# EAGLE design bitraf-bylarm-synth (EAGLE 6.5.0)
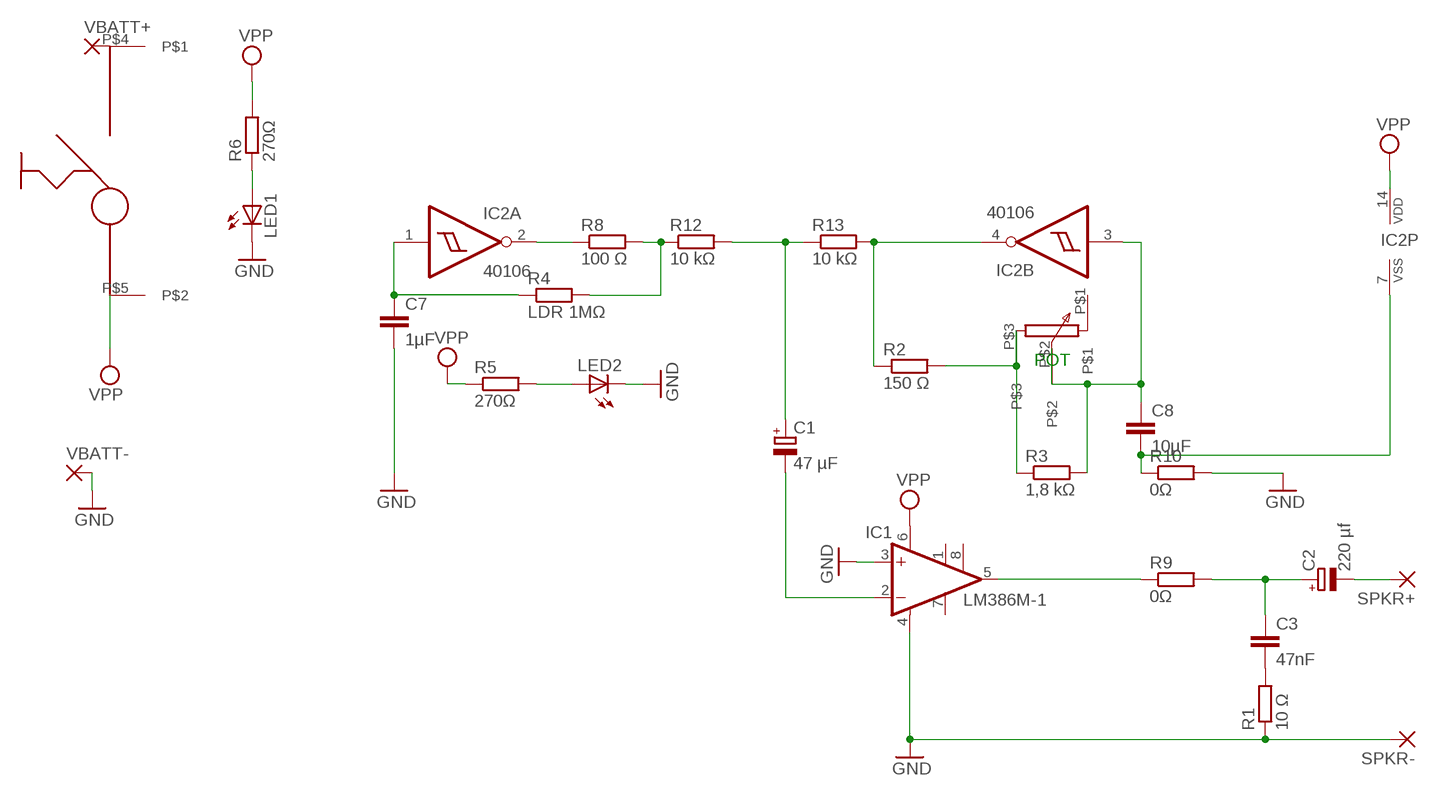
[diagram p0: schematic, sheet 1]

## Parts
C1  47 µF  CPOL-EU153CLV-0605  [153CLV-0605]
C2  220 µf  CPOL-EU153CLV-0605  [153CLV-0605]
C3  47nF  C-EUC0402  [C0402]
C7  1µF  C-EUC0603  [C0603]
C8  10µF  C-EUC1206  [C1206]
IC1  LM386M-1  [SO08]
IC2  40106  40106D  [SO14]
LED1  LED3MM  [LED3MM]
LED2  LEDP-LCC-2  [P-LCC-2]
R1  10 Ω  R-EU_R2512  [R2512]
R2  150 Ω  R-EU_R1206  [R1206]
R3  1,8 kΩ  R-EU_R1206  [R1206]
R4  LDR 1MΩ  R-EU_0204/2V  [0204V]
R5  270Ω  R-EU_R2512  [R2512]
R6  270Ω  R-EU_R2512  [R2512]
R8  100 Ω  R-EU_R1206  [R1206]
R9  0Ω  R-EU_R1206  [R1206]
R10  0Ω  R-EU_R1206  [R1206]
R12  10 kΩ  R-EU_R1206  [R1206]
R13  10 kΩ  R-EU_R1206  [R1206]
SPKR+  1,6/0,9  [1,6/0,9]
SPKR-  1,6/0,9  [1,6/0,9]
U$1  SMALLPOT  [SMALLPOT]
U$2  BYLARMSWITCH  [BYLARMSWITCH]
VBATT+  2,15/1,0  [2,15/1,0]
VBATT-  2,15/1,0  [2,15/1,0]

## Nets
GND: C7.2 IC1.3(+IN) IC1.4(GND) LED1.K(C) LED2.C R1.1 R10.2 SPKR-.1(P) VBATT-.1(P)
N$1: R4.2 R8.2 R12.1
N$2: C2.+ C3.1 R9.2
N$3: C1.- IC1.2(-IN)
N$4: C3.2 R1.2
N$5: R2.2 R3.1 U$1.P$3
N$6: C8.1 IC2.3(B:I) R3.2 U$1.P$2
N$7: LED1.A R6.1
N$8: LED2.A R5.2
N$9: U$2.P$4 VBATT+.1(P)
N$10: C1.+ R12.2 R13.1
N$11: C7.1 IC2.1(A:I) R4.1
N$12: C8.2 IC2.7(P:VSS) R10.1
N$13: IC1.5(OUT) R9.1
N$15: IC2.2(A:O) R8.1
N$21: IC2.4(B:O) R2.1 R13.2
SPKR+: C2.- SPKR+.1(P)
VPP: IC1.6(VS) IC2.14(P:VDD) R5.1 R6.2 U$2.P$5
Unconnected: IC1.1(GAIN) IC1.7(BYPASS) IC1.8(GAIN) IC2.5(C:I) IC2.6(C:O) IC2.8(D:O) IC2.9(D:I) IC2.10(E:O) IC2.11(E:I) IC2.12(F:O) IC2.13(F:I) U$1.P$1

## Notes on the sheet
- POT

## Library data of the parts
C1 C2 = rcl:CPOL-EU: POLARIZED CAPACITOR, European symbol
C3 C7 C8 = rcl:C-EU: CAPACITOR, European symbol
IC1 = linear:LM386?-*: Low Voltage Audio Power Amplifier Source: http://cache.national.com/ds/LM/LM386.pdf
IC2 = 40xx:40106: Hex SCHMITT TRIGGER
LED1 LED2 = led:LED: LED OSRAM: - CHIPLED LG R971, LG N971, LY N971, LG Q971, LY Q971, LO R971, LY R971 LH N974, LH R974 LS Q976, LO Q976, LY Q976 LO Q996 - Hyper CHIPLED LW Q18S LB Q993, LB Q99A, LB R99A - SideLED LS A670, LO A670, LY A670, LG A670, LP A670 LB A673, LV A673, LT A673, LW A673 LH A674 LY A675 LS A676, LA A676, LO A676, LY A676, LW A676 LS A679, LY A679, LG A679 - Hyper Micro SIDELED® LS Y876, LA Y876, LO Y876, LY Y876 LT Y87S - SmartLED LW L88C, LW L88S LB L89C, LB L89S, LG L890 LS L89K, LO L89K, LY L89K LS L896, LA L896, LO L896, LY L896 - TOPLED LS T670, LO T670, LY T670, LG T670, LP T670 LSG T670, LSP T670, LSY T670, LOP T670, LYG T670 LG T671, LOG T671, LSG T671 LB T673, LV T673, LT T673, LW T673 LH T674 LS T676, LA T676, LO T676, LY T676, LB T676, LH T676, LSB T676, LW T676 LB T67C, LV T67C, LT T67C, LS T67K, LO T67K, LY T67K, LW E67C LS E67B, LA E67B, LO E67B, LY E67B, LB E67C, LV E67C, LT E67C LW T67C LS T679, LY T679, LG T679 LS T770, LO T770, LY T770, LG T770, LP T770 LB T773, LV T773, LT T773, LW T773 LH T774 LS E675, LA E675, LY E675, LS T675 LS T776, LA T776, LO T776, LY T776, LB T776 LHGB T686 LT T68C, LB T68C - Hyper Mini TOPLED® LB M676 - Mini TOPLED Santana® LG M470 LS M47K, LO M47K, LY M47K Source: http://www.osram.convergy.de LUXEON: - LUMILED® LXK2-PW12-R00, LXK2-PW12-S00, LXK2-PW14-U00, LXK2-PW14-V00 LXK2-PM12-R00, LXK2-PM12-S00, LXK2-PM14-U00 LXK2-PE12-Q00, LXK2-PE12-R00, LXK2-PE12-S00, LXK2-PE14-T00, LXK2-PE14-U00 LXK2-PB12-K00, LXK2-PB12-L00, LXK2-PB12-M00, LXK2-PB14-N00, LXK2-PB14-P00, LXK2-PB14-Q00 LXK2-PR12-L00, LXK2-PR12-M00, LXK2-PR14-Q00, LXK2-PR14-R00 LXK2-PD12-Q00, LXK2-PD12-R00, LXK2-PD12-S00 LXK2-PH12-R00, LXK2-PH12-S00 LXK2-PL12-P00, LXK2-PL12-Q00, LXK2-PL12-R00 Source: www.luxeon.com KINGBRIGHT: KA-3528ASYC Source: www.kingbright.com
R1-R6 R8-R10 R12 R13 = rcl:R-EU_: RESISTOR, European symbol
SPKR+ SPKR- = wirepad:1,6/0,9: THROUGH-HOLE PAD
U$1 = smallpot:SMALLPOT
U$2 = bylarmSwitch:BYLARMSWITCH
VBATT+ VBATT- = wirepad:2,15/1,0: THROUGH-HOLE PAD

## Board
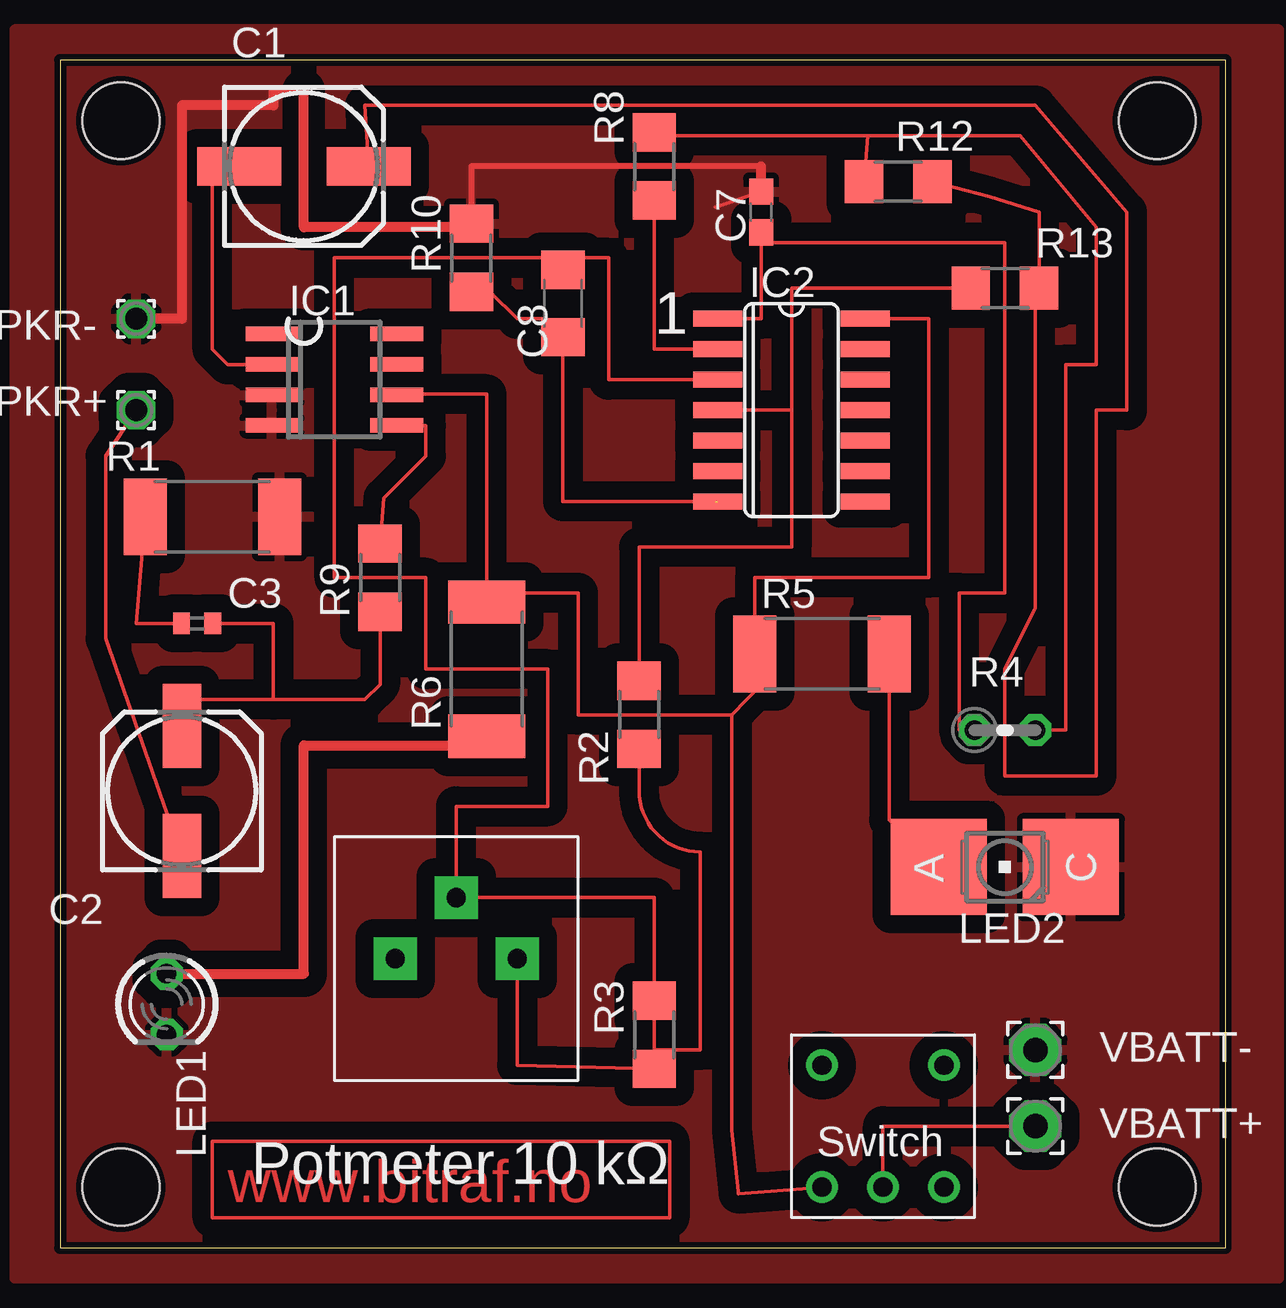
[diagram p1: board, top side]
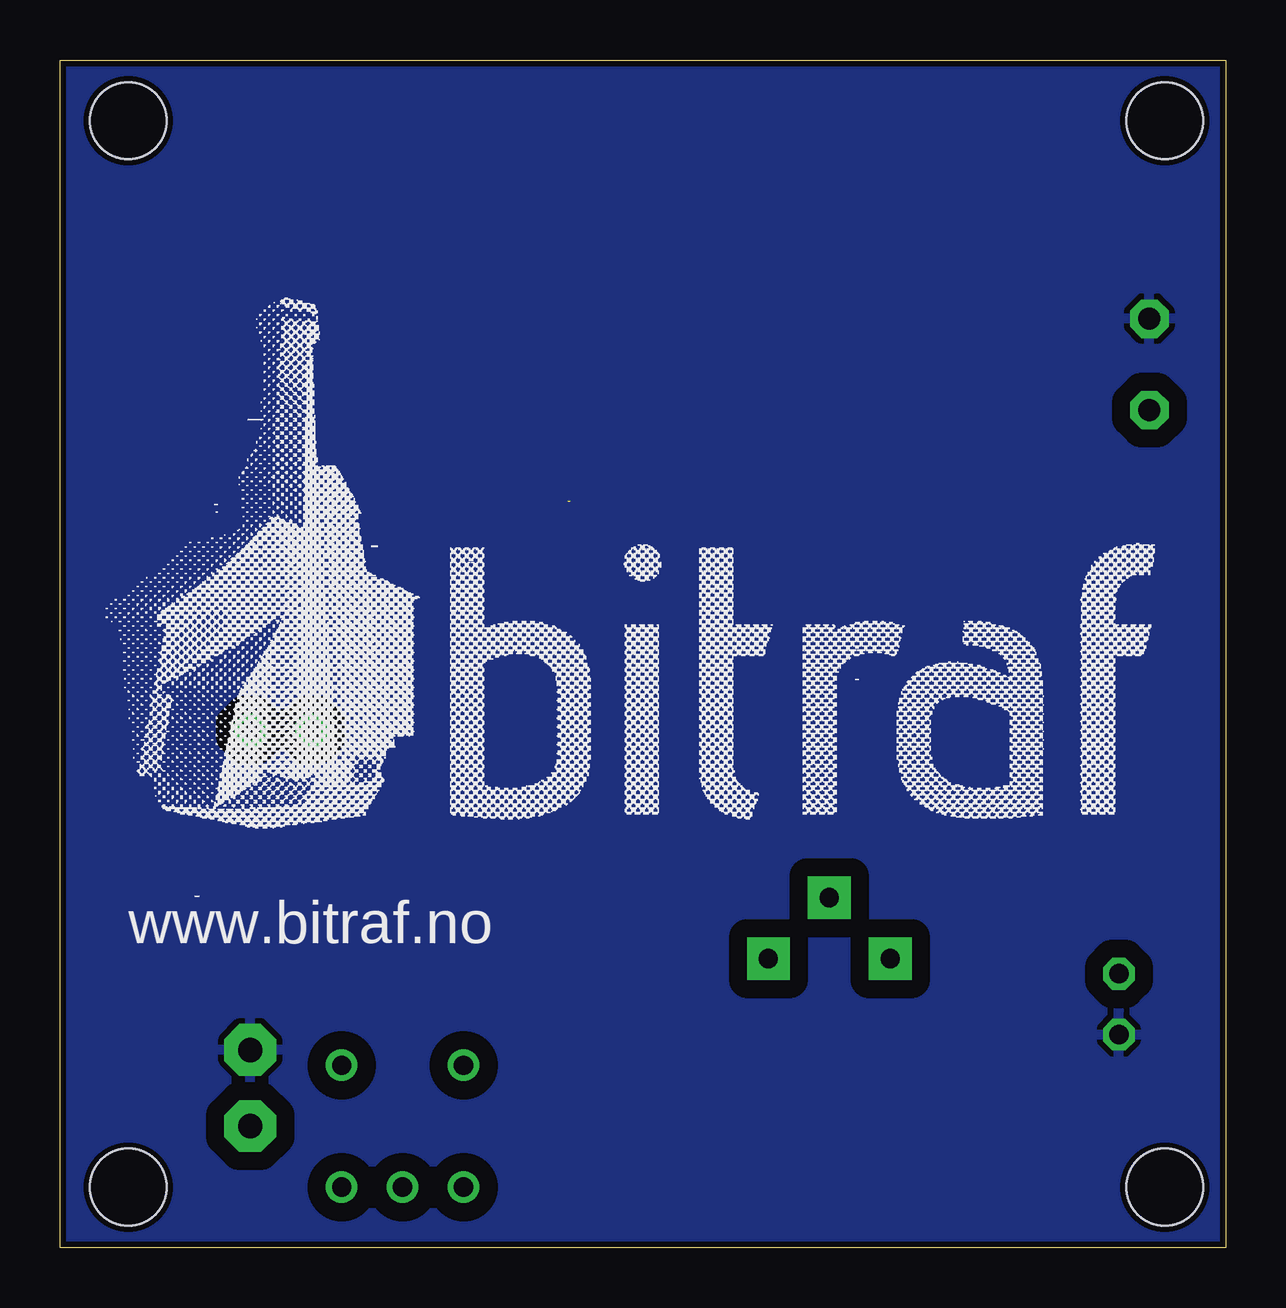
[diagram p2: board, bottom side, seen from below]

Size 48.56 x 49.52 mm. Coordinates in mm from the lower left corner, seen from the top.
Outline: 0,0 48.56,0 48.56,49.52 0,49.52 0,0
Copper layers (1*16): Top 0.035mm / dielectric 1.5mm / Bottom 0.035mm
Design rules "SeeedStudio_DRU-2layer_no_angle_20130527 *": minimum track width 6mil, minimum drill 12mil, track to track 30mil, track to pad 30mil, pad to pad 30mil, via to via 30mil, smd to smd 0mil, copper to edge 10mil, drill to drill 10mil, minimum pad ring 10mil, minimum via ring 6mil, stop-mask expansion 2mil, vias tented up to drill 25mil, thermal gap 10mil
Holes 3.2 mm at 2.54,2.54 2.54,46.99 45.72,46.99 45.72,2.54

### Footprints (pad centres in the part's own frame; a part is rotated, then mirrored left to right if it is on the bottom)
153CLV-0605 = smd 3.5 x 1.6: + 2.7,0; - -2.7,0
C0402 = smd 0.7 x 0.9: 1 -0.65,0; 2 0.65,0
C0603 = smd 1.1 x 1: 1 -0.85,0; 2 0.85,0
C1206 = smd 1.6 x 1.8: 1 -1.4,0; 2 1.4,0
SO08 = smd 0.6 x 2.2: 1 -1.905,-2.6; 2 -0.635,-2.6; 3 0.635,-2.6; 4 1.905,-2.6; 5 1.905,2.6; 6 0.635,2.6; 7 -0.635,2.6; 8 -1.905,2.6
SO14 = smd 0.66 x 2.032: 1 -3.81,-3.073; 2 -2.54,-3.073; 3 -1.27,-3.073; 4 0,-3.073; 5 1.27,-3.073; 6 2.54,-3.073; 7 3.81,-3.073; 8 3.81,3.073; 9 2.54,3.073; 10 1.27,3.073; 11 0,3.073; 12 -1.27,3.073; 13 -2.54,3.073; 14 -3.81,3.073
LED3MM = drill 0.813 octagon: A -1.27,0; K 1.27,0
P-LCC-2 = smd 4 x 4: A 0,2.75; C 0,-2.75
R2512 = smd 1.8 x 3.2: 1 -2.8,0; 2 2.8,0
R1206 = smd 1.6 x 1.803: 1 -1.422,0; 2 1.422,0
0204V = drill 0.813 octagon: 1 -1.27,0; 2 1.27,0
1,6/0,9 = drill 0.914 pad 1.6 octagon: 1 0,0
SMALLPOT = drill 0.8 pad 1.778 square: P$1 2.54,5.08; P$2 5.08,7.62; P$3 7.62,5.08
BYLARMSWITCH = drill 0.8: P$1 1.27,1.27; P$2 6.35,1.27; P$3 1.27,6.35; P$4 3.81,6.35; P$5 6.35,6.35
2,15/1,0 = drill 1.016 pad 2.159 octagon: 1 0,0

### Placement (x,y rotation side)
C1  10.16,45.09 0 top
C2  5.08,19.05 90 top
C3  5.71,26.04 180 top
C7  29.21,43.18 90 top
C8  20.95,39.37 270 top
IC1  11.43,36.2 270 top
IC2  30.48,34.92 270 top
LED1  4.45,10.16 270 top
LED2  39.37,15.88 90 top
R1  6.35,30.48 180 top
R2  24.13,22.23 270 top
R3  24.77,8.89 90 top
R4  39.37,21.59 0 top
R5  31.75,24.77 0 top
R6  17.78,24.13 90 top
R8  24.77,45.09 90 top
R9  13.34,27.94 270 top
R10  17.14,41.27 90 top
R12  34.92,44.45 0 top
R13  39.37,40.01 180 top
SPKR+  3.17,34.92 0 top
SPKR-  3.17,38.73 0 top
U$1  11.43,6.99 0 top
U$2  38.1,8.89 180 top
VBATT+  40.64,5.08 270 top
VBATT-  40.64,8.26 270 top

### Tracks (layer width: path | path; a pad name or v marks a point on that pad's centre or on a via)
GND
  Top 0.152: C7.2 27.3,43.4
  Top 0.254: 29.21,45.09 17.14,45.09 R10.2
  Top 0.406: C7.2 29.21,45.09 | R10.2 17.14,42.55 10.16,42.55 10.16,48.26 8.89,48.26 8.89,47.62 5.08,47.62 5.08,38.73 SPKR-.1
  pour Top: -2.54,52.07 52.07,52.07 52.07,50.8 52.07,-2.54 -2.54,-2.54 -2.54,-1.27
  pour Bottom: -1.27,50.8 -1.27,-1.27 50.8,-1.27 50.8,50.8
N$1
  Top 0.152: R4.2 41.91,21.59 41.91,36.83 43.18,36.83 43.18,42.55 40.01,46.35 33.66,46.35 | 33.66,46.35 24.77,46.35 R8.2 | 33.66,46.35 R12.1
N$2
  Top 0.152: R9.2 13.34,23.5 12.7,22.86 8.89,22.86 | 5.71,22.86 5.08,22.86 C2.+ 5.71,22.86 | C3.1 8.89,26.04 8.89,22.86 | 8.89,22.86 5.71,22.86
N$3
  Top 0.152: IC1.2 6.99,36.83 6.35,37.47 6.35,45.09 C1.-
N$4
  Top 0.152: C3.2 3.17,26.04 R1.2 3.81,30.48
N$5
  Top 0.152: R3.1 19.05,7.62 U$1.P$3 | R3.1 24.77,10.16 | R3.1 24.77,8.26 26.67,8.26 26.67,16.51 arc-90 24.13,19.05 R2.2
N$6
  Top 0.152: 20.32,41.27 22.86,41.27 22.86,36.2 IC2.3 | 24.77,12.7 R3.2 24.77,14.61 U$1.P$2 16.51,18.41 20.32,18.41 20.32,24.13 15.24,24.13 15.24,27.94 11.43,27.94 11.43,41.27 20.32,41.27 | 20.32,41.27 C8.1
N$7
  Top 0.406: LED1.A 10.16,11.43 10.16,20.95 17.78,20.95 R6.1
N$8
  Top 0.152: 34.29,24.77 R5.2 34.55,17.85 35.92,16.48 36.01,16.48 LED2.A
N$9
  Top 0.152: U$2.P$4 34.29,5.08 VBATT+.1
N$10
  Top 0.152: C1.+ 12.7,47.62 40.64,47.62 44.45,43.18 44.45,34.92 43.18,34.92 43.18,19.68 39.37,19.68 39.37,24.13 40.64,26.67 40.64,40.64 R13.1 40.79,43.18 38.73,43.81 R12.2
N$11
  Top 0.152: R4.1 37.47,21.59 37.47,27.3 39.37,27.3 39.37,41.91 29.21,41.91 C7.1 29.21,38.73 IC2.1 27.3,38.73 26.45,38.52
N$12  (1 unrouted)
  Top 0.152: R10.1 17.93,39.85 19.05,38.73 20.19,38.73 C8.2 20.95,31.11 27.3,31.11
N$13
  Top 0.152: R9.1 13.49,31.27 15.24,33.02 15.24,34.29 IC1.5
N$14
  pour Top: -1.91,50.8 -1.91,-1.27 50.8,-1.27 50.8,50.8
N$15
  Top 0.152: R8.1 24.77,37.47 IC2.2
N$16
  Top 0.254: 17.14,42.55 10.16,42.55 10.16,48.26
N$19
  Top 0.152: 6.35,4.45 25.4,4.45 25.4,1.27 6.35,1.27 6.35,4.45
N$21
  Top 0.152: 30.48,34.92 30.48,29.21 24.13,29.21 R2.1 | IC2.4 30.48,34.92 | 30.48,34.92 30.48,40.01 R13.2
SPKR+
  Top 0.152: SPKR+.1 1.91,33.02 1.91,25.4 C2.-
VPP
  Top 0.152: 27.99,22.23 21.59,22.23 21.59,27.3 18.04,27.3 | 17.78,27.3 18.04,27.3 | 18.04,27.3 R6.2 17.78,35.59 14.03,35.59 IC1.6 | 27.99,22.23 29.21,23.5 29.21,24.77 R5.1 28.95,27.94 36.2,27.94 36.2,38.73 IC2.14 | 27.99,22.23 27.99,4.9 28.27,2.36 28.27,2.26 U$2.P$5

### Text on the board
Top: www.bitraf.no
tPlace: 1 | Potmeter 10 kΩ
bPlace: www.bitraf.no